# Altium schematic sheet Communication.SchDoc
size A4; SheetNumber: 4; SheetTotal: 5
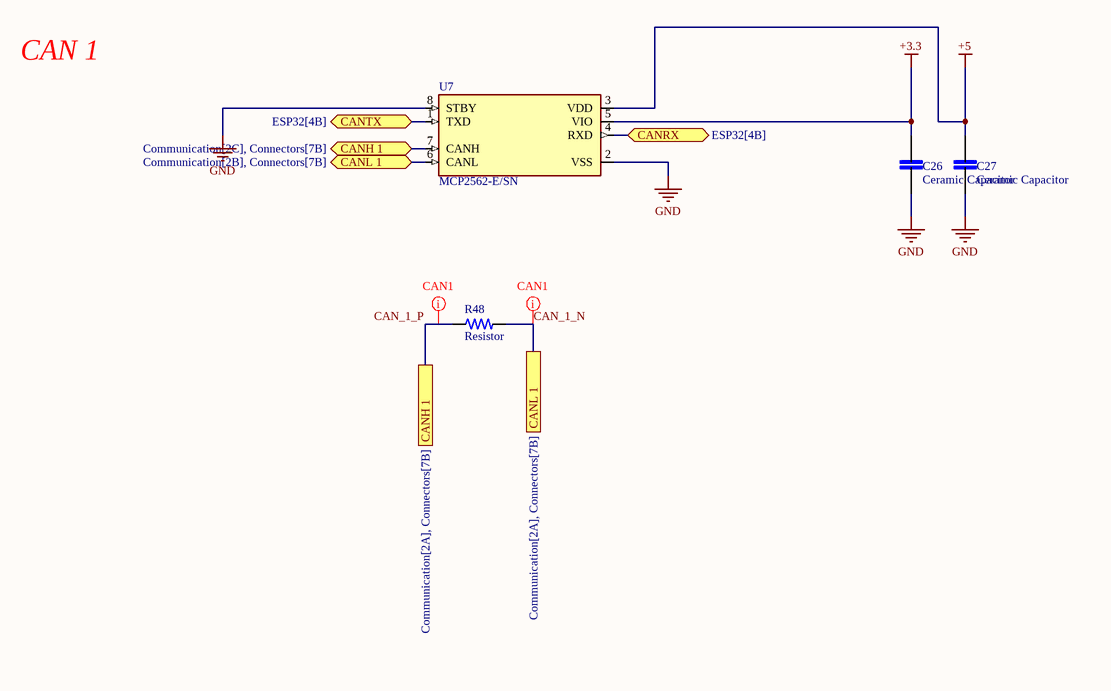
[diagram p0: Communication.SchDoc]

## Parts
C26  Ceramic Capacitor  [Ceramic Capacitor]
C27  Ceramic Capacitor  [Ceramic Capacitor]
R48  Resistor  [Resistor_Through Hole]
U7  MCP2562-E/SN  [MCP2562-E/SN]

## Ports
CANH 1 (bidir, see Communication[2C], Connectors[7B]), CANH 1 (see Communication[2A], Connectors[7B]), CANL 1 (bidir, see Communication[2B], Connectors[7B]), CANL 1 (see Communication[2A], Connectors[7B]), CANRX (bidir, see ESP32[4B]), CANTX (bidir, see ESP32[4B])

## Nets
+3.3: C26.2 U7.5(VIO)
+5: C27.2 U7.3(VDD)
GND: C26.1 C27.1 U7.2(VSS) U7.8(STBY)
CAN_1_N: R48.2 U7.6(CANL) ; port CANL 1
CAN_1_P: R48.1 U7.7(CANH) ; port CANH 1
CANRX: U7.4(RXD) ; port CANRX
CANTX: U7.1(TXD) ; port CANTX

## Layout directives
differential pair: CAN_1_N, CAN_1_P

## Notes on the sheet
- CAN 1

## Library data of the parts
C26 C27 = Ceramic Capacitor: MP: LD051A121KAB2A; MF: AVX; SnapEDA_Link: https://www.snapeda.com/parts/LD051A121KAB2A/AVX/view-part/?ref=snap; Package: 0805 AVX; Check_prices: https://www.snapeda.com/parts/LD051A121KAB2A/AVX/view-part/?ref=eda; Purchase-URL: https://pricing.snapeda.com/search/part/LD051A121KAB2A/?ref=eda; Price: None; Value: *; Availability: In Stock
R48 = Resistor: Power_Rating: .25 W; MP: 2-2176053-0; Tolerance: 1%; Resistance: .33; MF: TE Connectivity; Price: None; Availability: In Stock; EU_RoHS_Compliance: Compliant with Exemptions; Package: 0805; Value: *; SnapEDA_Link: https://www.snapeda.com/parts/2-2176053-0/TE+Connectivity/view-part/?ref=snap; Check_prices: https://www.snapeda.com/parts/2-2176053-0/TE+Connectivity/view-part/?ref=eda
U7 = MCP2562-E/SN: 1/1 Transceiver Half CANbus 8-SOIC; MF: Microchip; Value: *; Availability: Unavailable; Package: SO-8 Microchip; Price: None; SnapEDA_Link: https://www.snapeda.com/parts/MCP2562-E/SN/Microchip/view-part/1055306/?ref=snap; MP: MCP2562-E/SN